# EAGLE design TDA7386A (EAGLE 5.09)
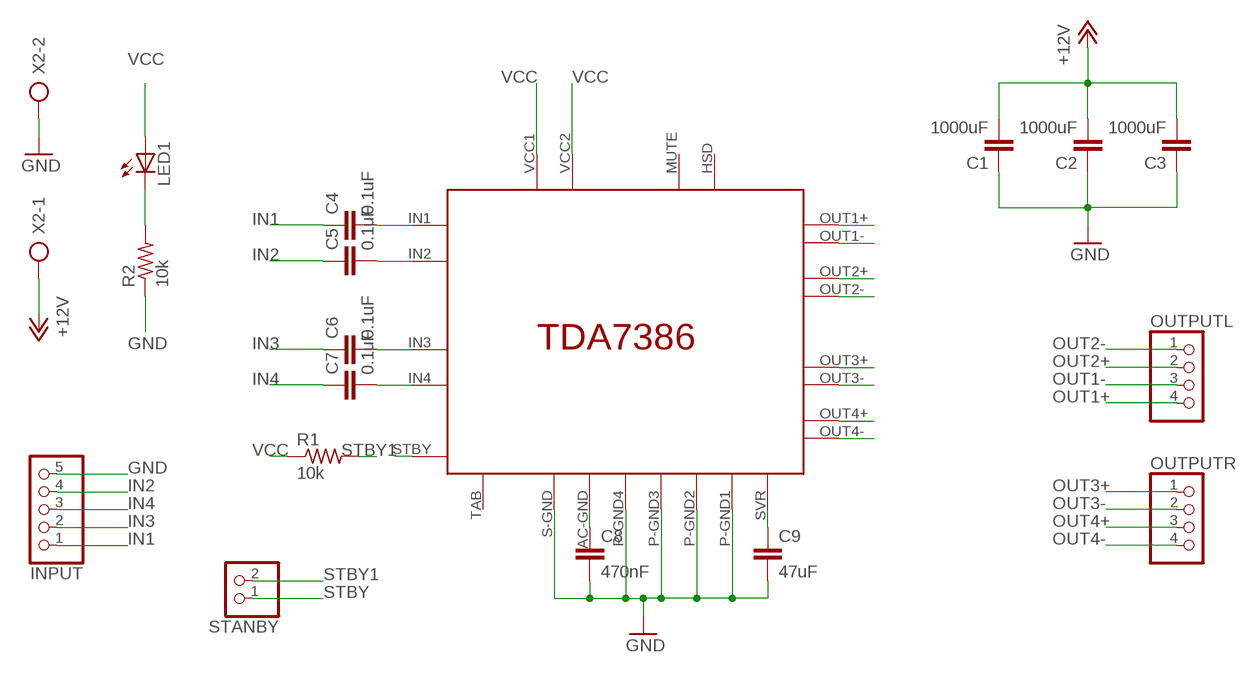
[diagram p0: schematic, sheet 1]

## Parts
C1  1000uF  C5/2.5  [C5B2.5]
C2  1000uF  C5/2.5  [C5B2.5]
C3  1000uF  C5/2.5  [C5B2.5]
C4  0.1uF  C2.5/2  [C2.5-2]
C5  0.1uF  C2.5/2  [C2.5-2]
C6  0.1uF  C2.5/2  [C2.5-2]
C7  0.1uF  C2.5/2  [C2.5-2]
C8  470nF  C2.5/6  [C2.5-6]
C9  47uF  C2.5/6  [C2.5-6]
INPUT  PINHD-1X5  [1X05]
LED1  LED5MM  [LED5MM]
OUTPUTL  PINHD-1X4  [1X04]
OUTPUTR  PINHD-1X4  [1X04]
R1  10k  R-US_0204/7  [0204/7]
R2  10k  R-US_0204/7  [0204/7]
STANBY  PINHD-1X2  [1X02]
U$1  TDA7386  [TDA7386]
X2  AK300/2  [AK300/2]

## Nets
GND: C1.1 C2.1 C3.1 C8.2 C9.2 INPUT.5 R2.1 U$1.P-GND1 U$1.P-GND2 U$1.P-GND3 U$1.P-GND4 U$1.S-GND X2.2
IN1: C4.1 INPUT.1
IN2: C5.1 INPUT.4
IN3: C6.1 INPUT.2
IN4: C7.1 INPUT.3
N$1: C8.1 U$1.AC-GND
N$3: C9.1 U$1.SVR
N$6: LED1.K(C) R2.2
N$15: C4.2 U$1.IN1
N$16: C5.2 U$1.IN2
N$17: C6.2 U$1.IN3
N$18: C7.2 U$1.IN4
OUT1+: OUTPUTL.4 U$1.OUT1+
OUT1-: OUTPUTL.3 U$1.OUT1-
OUT2+: OUTPUTL.2 U$1.OUT2+
OUT2-: OUTPUTL.1 U$1.OUT2-
OUT3+: OUTPUTR.1 U$1.OUT3+
OUT3-: OUTPUTR.2 U$1.OUT3-
OUT4+: OUTPUTR.3 U$1.OUT4+
OUT4-: OUTPUTR.4 U$1.OUT4-
STBY: STANBY.1 U$1.STBY
STBY1: R1.2 STANBY.2
VCC: C1.2 C2.2 C3.2 LED1.A R1.1 U$1.VCC1 U$1.VCC2 X2.1 ; supply symbol labelled +12V
Unconnected: U$1.HSD U$1.MUTE U$1.TAB

## Library data of the parts
C1-C9 = capacitor-wima:C: CAPACITOR naming: grid - package width
INPUT = pinhead:PINHD-1X5: PIN HEADER
LED1 = led:LED: LED OSRAM: - CHIPLED LG R971, LG N971, LY N971, LG Q971, LY Q971, LO R971, LY R971 LH N974, LH R974 LS Q976, LO Q976, LY Q976 LO Q996 - Hyper CHIPLED LW Q18S LB Q993, LB Q99A, LB R99A - SideLED LS A670, LO A670, LY A670, LG A670, LP A670 LB A673, LV A673, LT A673, LW A673 LH A674 LY A675 LS A676, LA A676, LO A676, LY A676, LW A676 LS A679, LY A679, LG A679 - Hyper Micro SIDELED® LS Y876, LA Y876, LO Y876, LY Y876 LT Y87S - SmartLED LW L88C, LW L88S LB L89C, LB L89S, LG L890 LS L89K, LO L89K, LY L89K LS L896, LA L896, LO L896, LY L896 - TOPLED LS T670, LO T670, LY T670, LG T670, LP T670 LSG T670, LSP T670, LSY T670, LOP T670, LYG T670 LG T671, LOG T671, LSG T671 LB T673, LV T673, LT T673, LW T673 LH T674 LS T676, LA T676, LO T676, LY T676, LB T676, LH T676, LSB T676, LW T676 LB T67C, LV T67C, LT T67C, LS T67K, LO T67K, LY T67K, LW E67C LS E67B, LA E67B, LO E67B, LY E67B, LB E67C, LV E67C, LT E67C LW T67C LS T679, LY T679, LG T679 LS T770, LO T770, LY T770, LG T770, LP T770 LB T773, LV T773, LT T773, LW T773 LH T774 LS E675, LA E675, LY E675, LS T675 LS T776, LA T776, LO T776, LY T776, LB T776 LHGB T686 LT T68C, LB T68C - Hyper Mini TOPLED® LB M676 - Mini TOPLED Santana® LG M470 LS M47K, LO M47K, LY M47K Source: http://www.osram.convergy.de LUXEON: - LUMILED® LXK2-PW12-R00, LXK2-PW12-S00, LXK2-PW14-U00, LXK2-PW14-V00 LXK2-PM12-R00, LXK2-PM12-S00, LXK2-PM14-U00 LXK2-PE12-Q00, LXK2-PE12-R00, LXK2-PE12-S00, LXK2-PE14-T00, LXK2-PE14-U00 LXK2-PB12-K00, LXK2-PB12-L00, LXK2-PB12-M00, LXK2-PB14-N00, LXK2-PB14-P00, LXK2-PB14-Q00 LXK2-PR12-L00, LXK2-PR12-M00, LXK2-PR14-Q00, LXK2-PR14-R00 LXK2-PD12-Q00, LXK2-PD12-R00, LXK2-PD12-S00 LXK2-PH12-R00, LXK2-PH12-S00 LXK2-PL12-P00, LXK2-PL12-Q00, LXK2-PL12-R00 Source: www.luxeon.com KINGBRIGHT: KA-3528ASYC Source: www.kingbright.com
OUTPUTL OUTPUTR = pinhead:PINHD-1X4: PIN HEADER
R1 R2 = resistor:R-US_: RESISTOR, American symbol
STANBY = pinhead:PINHD-1X2: PIN HEADER
U$1 = TDA7386:TDA7386: Amplificador cuadruple Cuatro canales de audio de 45watts
X2 = con-ptr500:AK300/2: CONNECTOR

## Board
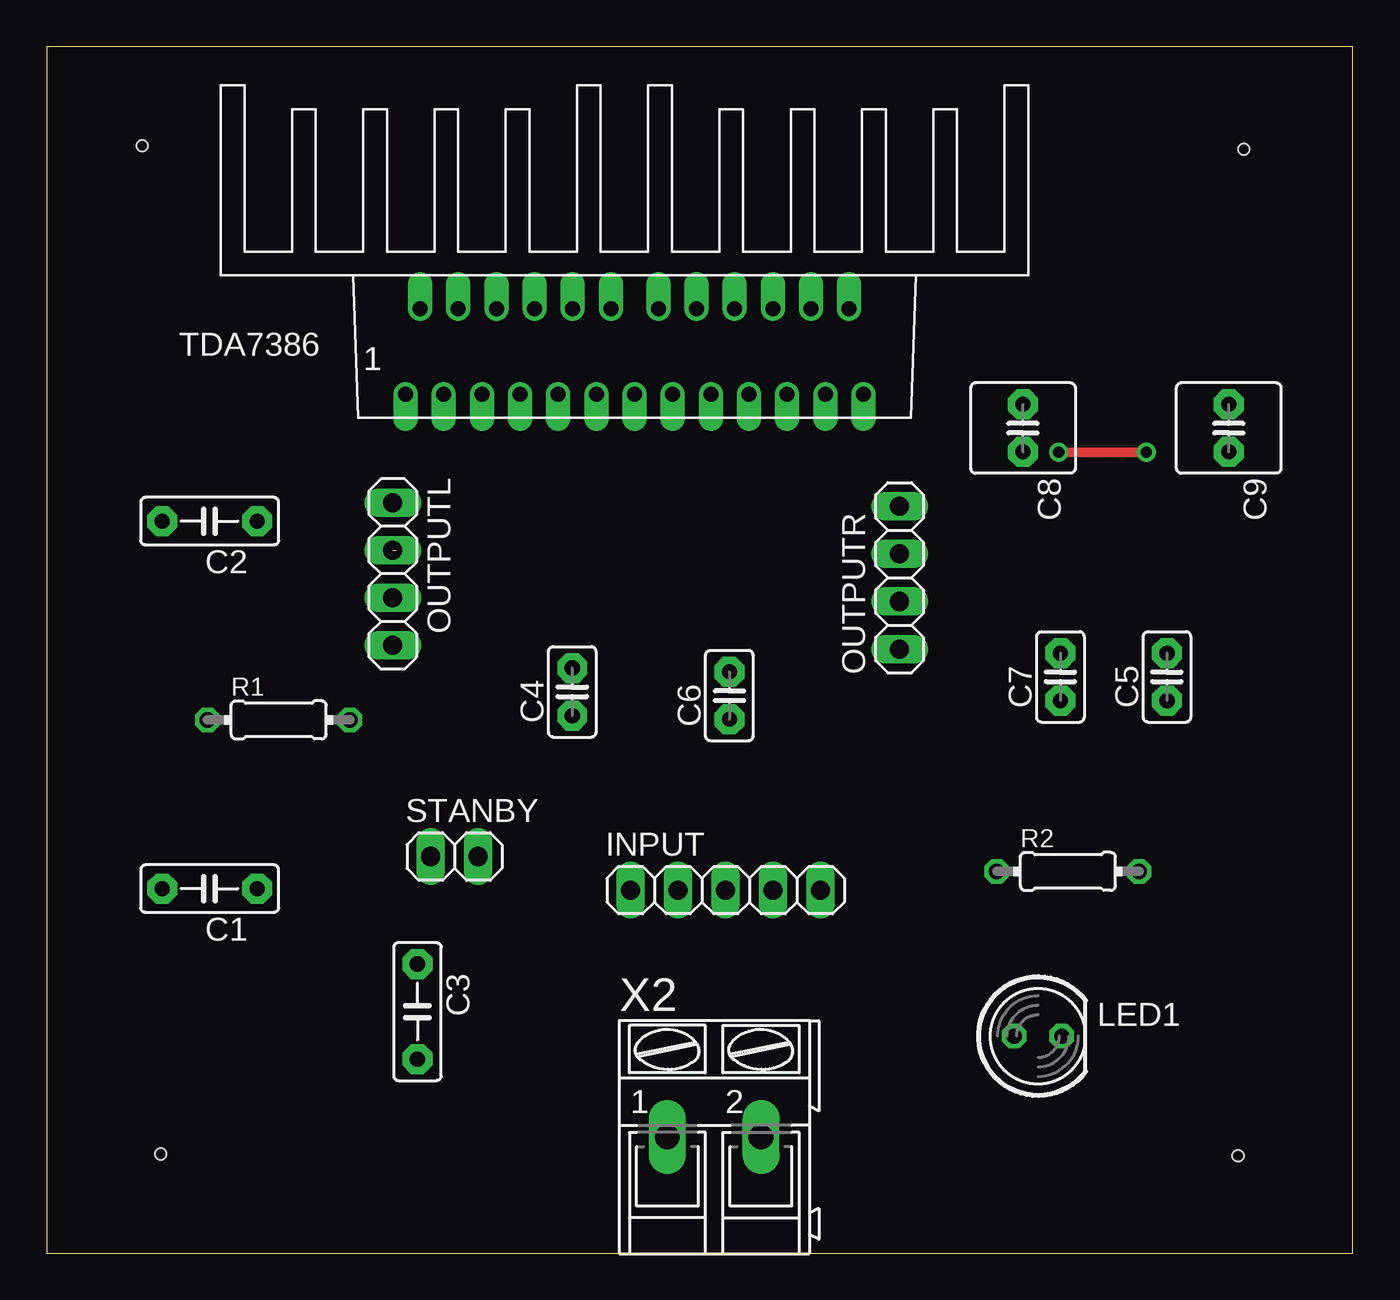
[diagram p1: board, top side]
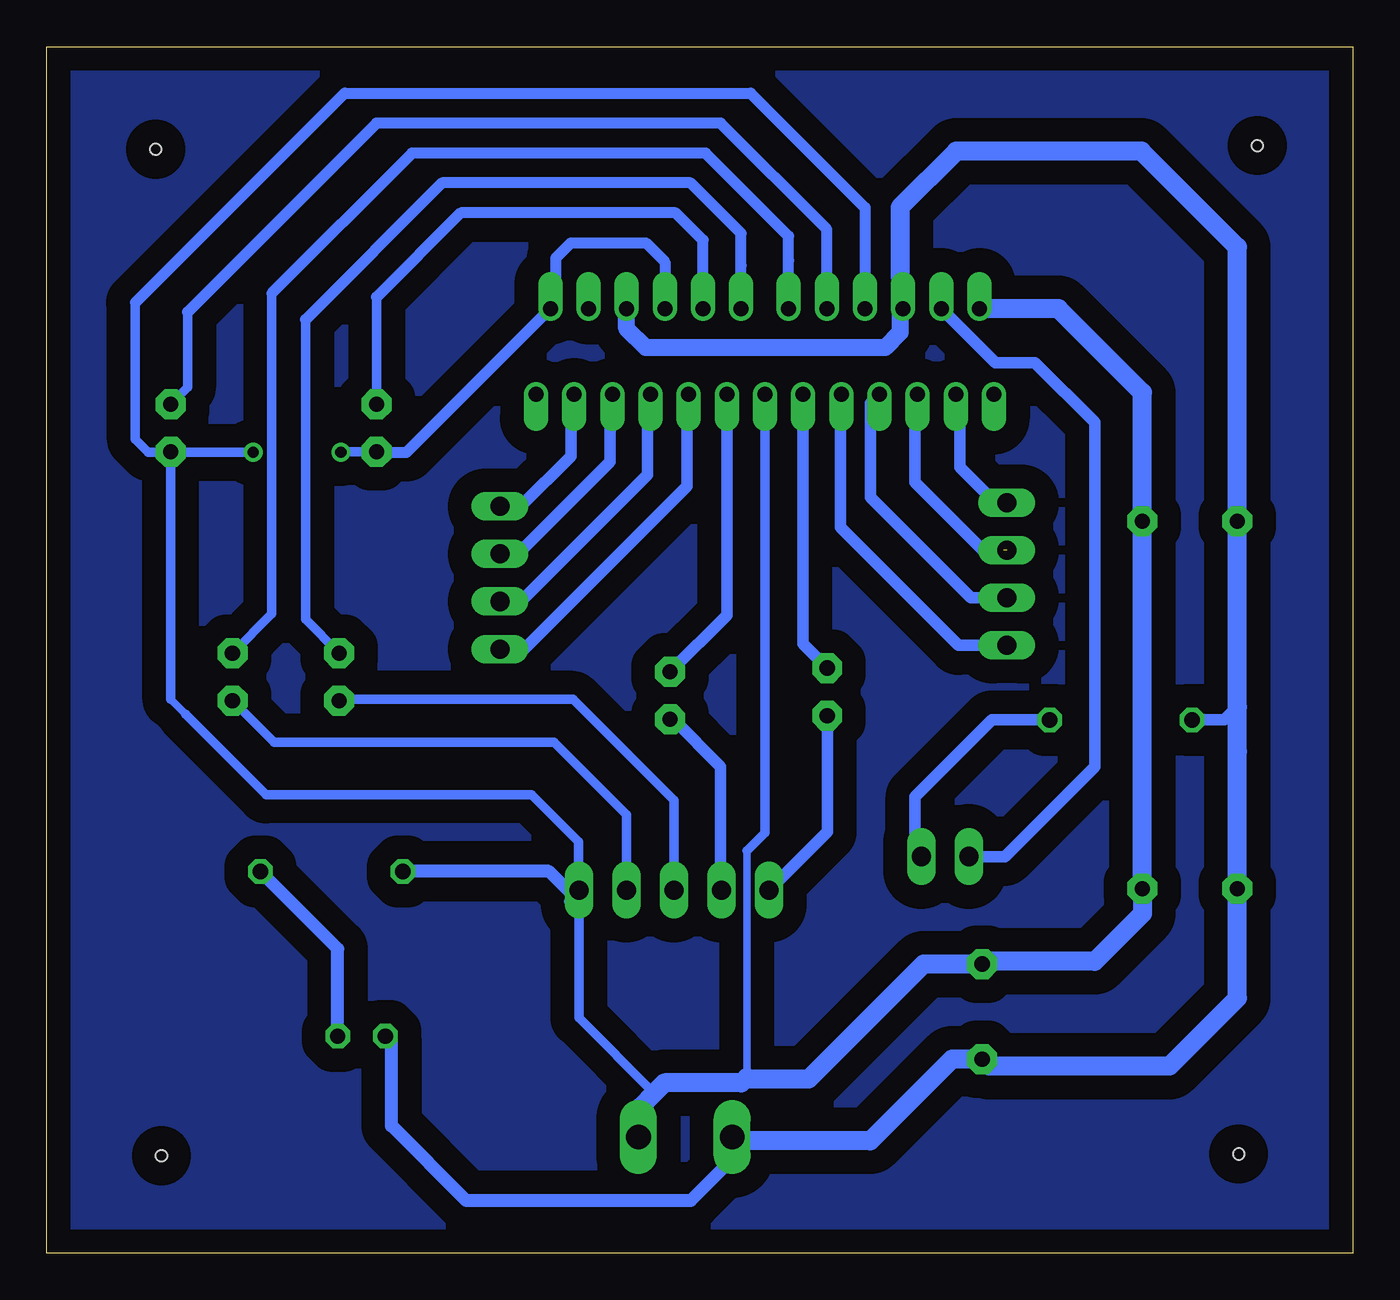
[diagram p2: board, bottom side, seen from below]

Size 69.83 x 64.48 mm. Coordinates in mm from the lower left corner, seen from the top.
Outline: 0,0 69.83,0 69.83,64.48 0,64.48 0,0
Copper layers (1*16): Top 0.035mm / dielectric 1.5mm / Bottom 0.035mm
Design rules "default": minimum track width 10mil, minimum drill 24mil, track to track 8mil, track to pad 8mil, pad to pad 8mil, via to via 8mil, smd to smd 8mil, copper to edge 40mil, drill to drill 8mil, minimum pad ring 10mil, minimum via ring 8mil, stop-mask expansion 4mil, vias tented up to drill 0mil, thermal gap 10mil
Holes 0.6 mm at 5.1,59.2 64,59 63.7,5.2 6.1,5.3

### Footprints (pad centres in the part's own frame; a part is rotated, then mirrored left to right if it is on the bottom)
C5B2.5 = drill 0.813 pad 1.6 octagon: 1 -2.54,0; 2 2.54,0
C2.5-2 = drill 0.813 pad 1.6 octagon: 1 -1.27,0; 2 1.27,0
C2.5-6 = drill 0.813 pad 1.6 octagon: 1 -1.27,0; 2 1.27,0
1X05 = drill 1.016 long: 1 -5.08,0; 2 -2.54,0; 3 0,0; 4 2.54,0; 5 5.08,0
LED5MM = drill 0.813 octagon: A -1.27,0; K 1.27,0
1X04 = drill 1.016 long: 1 -3.81,0; 2 -1.27,0; 3 1.27,0; 4 3.81,0
0204/7 = drill 0.813 octagon: 1 -3.81,0; 2 3.81,0
1X02 = drill 1.016 long: 1 -1.27,0; 2 1.27,0
TDA7386 = drill 0.8 offset: AC-GND 1.31,2.032; HSD 10.24,-2.54; IN1 -4.04,-2.54; IN2 -3.27,2.032; IN3 0.04,-2.54; IN4 -0.73,2.032; MUTE 7.43,2.032; OUT1+ -6.08,-2.54; OUT1- -8.12,-2.54; OUT2+ -10.16,-2.54; OUT2- -12.2,-2.54; OUT3+ 2.08,-2.54; OUT3- 4.12,-2.54; OUT4+ 6.16,-2.54; OUT4- 8.2,-2.54; P-GND1 -7.35,2.032; P-GND2 -13.47,2.032; P-GND3 3.35,2.032; P-GND4 9.47,2.032; S-GND -2,-2.54; STBY -11.43,2.032; SVR -5.31,2.032; TAB -14.24,-2.54; VCC1 -9.39,2.032; VCC2 5.39,2.032
AK300/2 = drill 1.321 long: 1 -2.515,0; 2 2.489,0

### Placement (x,y rotation side)
C1  8.71,19.48 180 top
C2  8.71,39.12 180 top
C3  19.82,12.91 270 top
C4  28.1,30 90 top
C5  59.9,30.8 90 top
C6  36.5,29.8 90 top
C7  54.2,30.8 90 top
C8  52.2,44.1 270 top
C9  63.2,44.1 270 top
INPUT  36.3,19.4 0 top
LED1  53,11.6 0 top
OUTPUTL  18.5,36.3 270 top
OUTPUTR  45.6,36.1 90 top
R1  12.4,28.5 0 top
R2  54.6,20.4 0 top
STANBY  21.8,21.2 0 top
U$1  33.43,48.45 0 top
X2  35.7,6.2 0 top

### Tracks (layer width: path | path; a pad name or v marks a point on that pad's centre or on a via)
GND  (via drill 0.6)
  Top 0.5: v58.8,42.8 v54.1,42.8
  Bottom 0.4: 32.4,9.4 32.4,21.5
  Bottom 0.406: INPUT.5 41.98,18.8 | 62.4,28.8 63.2,29.6
  Bottom 0.5: 37.35,8.55 41.38,12.58 41.38,18.8 INPUT.5 41.4,19.42 41.4,22 43.9,24.5 58.1,24.5 62.4,28.8 | U$1.S-GND 31.43,22.47 32.4,21.5 | 32.4,9.4 32.7,9.1 | 65.1,50.8 65.1,43.5 64.4,42.8 62.43,42.8 C9.2 | 53.87,42.83 C8.2 | 53.87,42.83 53.9,42.8 | v54.1,42.8 53.87,42.83 | v58.8,42.8 62.37,42.8 C9.2 | 63.2,29.6 C9.2
  Bottom 0.6: U$1.P-GND3 36.78,52.98 37.8,54 41.8,54 42.6,53.2 42.6,51.29 U$1.P-GND4 42.9,50.5 50.6,42.8 52.17,42.8 C8.2 | U$1.P-GND1 26.08,55.88 32.2,62 53.9,62 65.1,50.8
  Bottom 0.61: 11.25,46 11.25,46.05
  Bottom 0.7: R2.1 42.98,20.4 41.38,18.8
  Bottom 1.016: X2.2 38.09,7.81 37.35,8.55 36.8,9.1 32.7,9.1 | 32.4,9.4 32.3,9.3 29.1,9.3 22.95,15.45 C3.1 19.67,15.6 13.8,15.6 11.25,18.15 C1.1 C2.1 11.25,46 15.73,50.48 U$1.P-GND2
IN1
  Bottom 0.61: C4.1 28.1,22.52 INPUT.1
IN2
  Bottom 0.5: INPUT.4 38.84,23.44 42.7,27.3 57.67,27.3 C5.1
IN3
  Bottom 0.5: INPUT.2 34,19.64
  Bottom 0.61: C6.1 36.33,28.53 33.8,26 33.8,19.44 INPUT.2
IN4
  Bottom 0.5: INPUT.3 36.3,24.2 41.7,29.6 54.13,29.6 C7.1
N$1
  Bottom 0.5: 52.2,51.1 C8.1
  Bottom 0.6: U$1.AC-GND 34.74,52.04 34.74,54.14 36.2,55.6 47.7,55.6 52.2,51.1
N$2
  pour Bottom (isolate 1.27, no thermals): -0.6,64.4 69.8,64.4 69.8,-0.4 -0.6,-0.4
N$3
  Bottom 0.5: 62.3,50.3 62.3,46.27 C9.1
  Bottom 0.6: U$1.SVR 28.12,54.12 28.12,54.72 33.8,60.4 52.2,60.4 62.3,50.3
N$6
  Bottom 0.7: LED1.K 54.27,16.26 R2.2
N$15
  Bottom 0.61: U$1.IN1 29.39,32.56 C4.2
N$16
  Bottom 0.5: 57.8,51.3 57.8,34.17 C5.2
  Bottom 0.6: U$1.IN2 30.16,53.06 30.16,54.36 34.6,58.8 50.3,58.8 57.8,51.3
N$17
  Bottom 0.61: U$1.IN3 33.47,34.1 C6.2
N$18
  Bottom 0.5: 56,49.9 56,33.87 C7.2
  Bottom 0.6: U$1.IN4 32.7,52.8 32.7,54.5 35.4,57.2 48.7,57.2 56,49.9
OUT1+
  Bottom 0.61: OUTPUTL.4 21.09,32.49 27.4,38.8 27.4,45.86 U$1.OUT1+
OUT1-
  Bottom 0.61: OUTPUTL.3 20.43,35.03 25.8,40.4 25.8,45.42 U$1.OUT1-
OUT2+  (1 unrouted)
  Bottom 0.61: 18.67,37.57 19.77,37.57 23.4,41.2 23.4,45.78 U$1.OUT2+
OUT2-
  Bottom 0.61: OUTPUTL.1 19.11,40.11 21,42 21,45.68 U$1.OUT2-
OUT3+
  Bottom 0.61: OUTPUTR.1 44.31,32.29 35.6,41 35.6,45.49 U$1.OUT3+
OUT3-
  Bottom 0.61: OUTPUTR.2 44.47,34.83 37.7,41.6 37.7,45.43 U$1.OUT3-
OUT4+
  Bottom 0.61: OUTPUTR.3 44.63,37.37 39.7,42.3 39.7,44.67 U$1.OUT4+
OUT4-
  Bottom 0.61: OUTPUTR.4 44.49,39.91 41.8,42.6 41.8,45.41 U$1.OUT4-
STBY
  Bottom 0.61: STANBY.1 18.6,21.2 13.8,26 13.8,44.4 17,47.6 19.12,47.6 U$1.STBY
STBY1
  Bottom 0.61: R1.2 19.3,28.5 23.4,24.4 23.4,21.53 STANBY.2
VCC
  Bottom 0.406: X2.1 33.19,5.02 | 6.17,26.8 6.17,26.9
  Bottom 0.5: 51.4,11.27 LED1.A
  Bottom 0.6: U$1.VCC1 24.2,50.83
  Bottom 0.61: 6.17,26.8 6.27,26.9 | R1.1 6.87,28.5 6.17,29.2
  Bottom 0.7: 33.19,5.02 35.4,2.8 47.4,2.8 51.4,6.8 51.4,11.27
  Bottom 0.813: 19.45,10 C3.2 | 32.98,6 X2.1
  Bottom 0.9: U$1.VCC2 38.82,49.42 37.8,48.4 25,48.4 24.2,49.2 24.2,50.83
  Bottom 1.016: U$1.VCC1 24.2,52.28 24.2,55.9 21.2,58.9 11.3,58.9 6.17,53.77 C2.2 6.17,29.2 6.17,26.8 C1.2 6.17,13.63 9.8,10 19.45,10 | C3.2 21.43,10.37 25.8,6 32.98,6